# EAGLE design indicators (EAGLE 6.6.0)
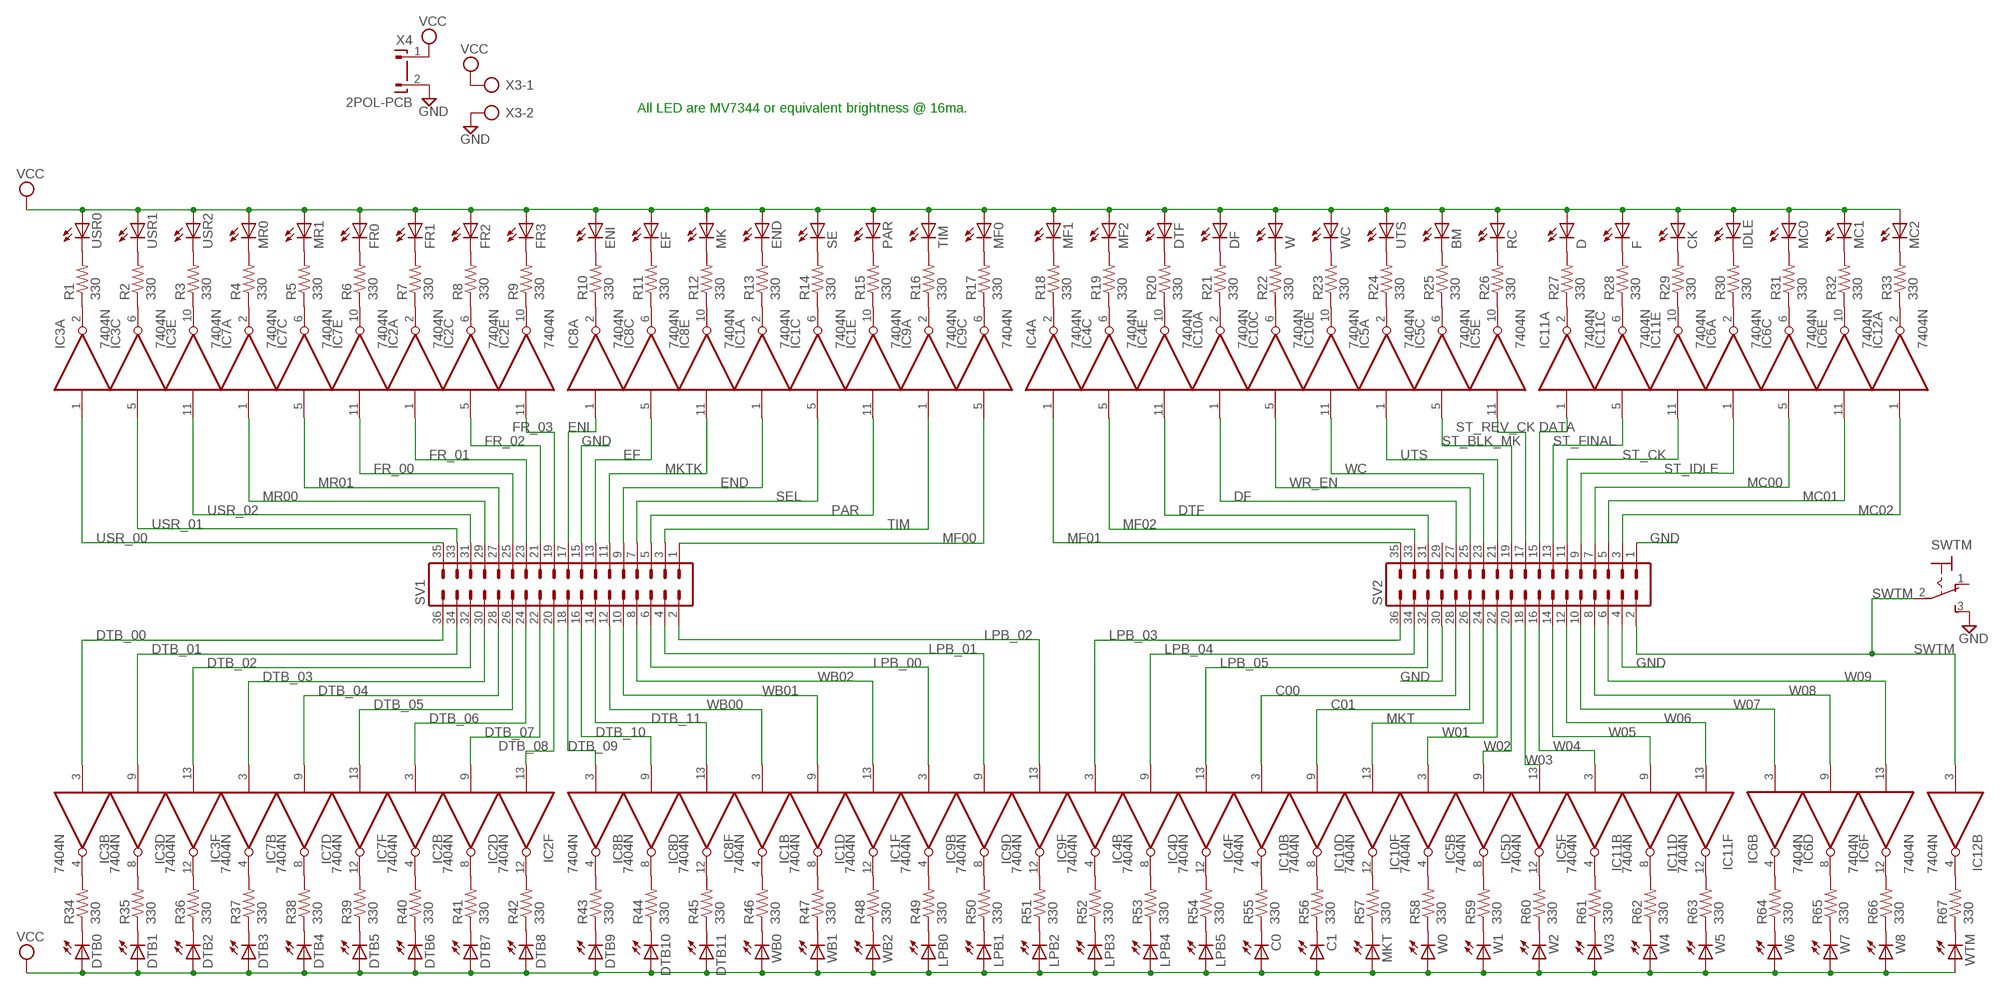
[diagram p0: schematic, sheet 1]

## Parts
BM  LED5MM  [LED5MM]
C0  LED5MM  [LED5MM]
C1  LED5MM  [LED5MM]
CK  LED5MM  [LED5MM]
D  LED5MM  [LED5MM]
DF  LED5MM  [LED5MM]
DTB0  LED5MM  [LED5MM]
DTB1  LED5MM  [LED5MM]
DTB2  LED5MM  [LED5MM]
DTB3  LED5MM  [LED5MM]
DTB4  LED5MM  [LED5MM]
DTB5  LED5MM  [LED5MM]
DTB6  LED5MM  [LED5MM]
DTB7  LED5MM  [LED5MM]
DTB8  LED5MM  [LED5MM]
DTB9  LED5MM  [LED5MM]
DTB10  LED5MM  [LED5MM]
DTB11  LED5MM  [LED5MM]
DTF  LED5MM  [LED5MM]
EF  LED5MM  [LED5MM]
END  LED5MM  [LED5MM]
ENI  LED5MM  [LED5MM]
F  LED5MM  [LED5MM]
FR0  LED5MM  [LED5MM]
FR1  LED5MM  [LED5MM]
FR2  LED5MM  [LED5MM]
FR3  LED5MM  [LED5MM]
IC1  7404N  [DIL14]
IC2  7404N  [DIL14]
IC3  7404N  [DIL14]
IC4  7404N  [DIL14]
IC5  7404N  [DIL14]
IC6  7404N  [DIL14]
IC7  7404N  [DIL14]
IC8  7404N  [DIL14]
IC9  7404N  [DIL14]
IC10  7404N  [DIL14]
IC11  7404N  [DIL14]
IC12  7404N  [DIL14]
IDLE  LED5MM  [LED5MM]
LPB0  LED5MM  [LED5MM]
LPB1  LED5MM  [LED5MM]
LPB2  LED5MM  [LED5MM]
LPB3  LED5MM  [LED5MM]
LPB4  LED5MM  [LED5MM]
LPB5  LED5MM  [LED5MM]
MC0  LED5MM  [LED5MM]
MC1  LED5MM  [LED5MM]
MC2  LED5MM  [LED5MM]
MF0  LED5MM  [LED5MM]
MF1  LED5MM  [LED5MM]
MF2  LED5MM  [LED5MM]
MK  LED5MM  [LED5MM]
MKT  LED5MM  [LED5MM]
MR0  LED5MM  [LED5MM]
MR1  LED5MM  [LED5MM]
PAR  LED5MM  [LED5MM]
R1  330  R-US_0207/10  [0207/10]
R2  330  R-US_0207/10  [0207/10]
R3  330  R-US_0207/10  [0207/10]
R4  330  R-US_0207/10  [0207/10]
R5  330  R-US_0207/10  [0207/10]
R6  330  R-US_0207/10  [0207/10]
R7  330  R-US_0207/10  [0207/10]
R8  330  R-US_0207/10  [0207/10]
R9  330  R-US_0207/10  [0207/10]
R10  330  R-US_0207/10  [0207/10]
R11  330  R-US_0207/10  [0207/10]
R12  330  R-US_0207/10  [0207/10]
R13  330  R-US_0207/10  [0207/10]
R14  330  R-US_0207/10  [0207/10]
R15  330  R-US_0207/10  [0207/10]
R16  330  R-US_0207/10  [0207/10]
R17  330  R-US_0207/10  [0207/10]
R18  330  R-US_0207/10  [0207/10]
R19  330  R-US_0207/10  [0207/10]
R20  330  R-US_0207/10  [0207/10]
R21  330  R-US_0207/10  [0207/10]
R22  330  R-US_0207/10  [0207/10]
R23  330  R-US_0207/10  [0207/10]
R24  330  R-US_0207/10  [0207/10]
R25  330  R-US_0207/10  [0207/10]
R26  330  R-US_0207/10  [0207/10]
R27  330  R-US_0207/10  [0207/10]
R28  330  R-US_0207/10  [0207/10]
R29  330  R-US_0207/10  [0207/10]
R30  330  R-US_0207/10  [0207/10]
R31  330  R-US_0207/10  [0207/10]
R32  330  R-US_0207/10  [0207/10]
R33  330  R-US_0207/10  [0207/10]
R34  330  R-US_0207/10  [0207/10]
R35  330  R-US_0207/10  [0207/10]
R36  330  R-US_0207/10  [0207/10]
R37  330  R-US_0207/10  [0207/10]
R38  330  R-US_0207/10  [0207/10]
R39  330  R-US_0207/10  [0207/10]
R40  330  R-US_0207/10  [0207/10]
R41  330  R-US_0207/10  [0207/10]
R42  330  R-US_0207/10  [0207/10]
R43  330  R-US_0207/10  [0207/10]
R44  330  R-US_0207/10  [0207/10]
R45  330  R-US_0207/10  [0207/10]
R46  330  R-US_0207/10  [0207/10]
R47  330  R-US_0207/10  [0207/10]
R48  330  R-US_0207/10  [0207/10]
R49  330  R-US_0207/10  [0207/10]
R50  330  R-US_0207/10  [0207/10]
R51  330  R-US_0207/10  [0207/10]
R52  330  R-US_0207/10  [0207/10]
R53  330  R-US_0207/10  [0207/10]
R54  330  R-US_0207/10  [0207/10]
R55  330  R-US_0207/10  [0207/10]
R56  330  R-US_0207/10  [0207/10]
R57  330  R-US_0207/10  [0207/10]
R58  330  R-US_0207/10  [0207/10]
R59  330  R-US_0207/10  [0207/10]
R60  330  R-US_0207/10  [0207/10]
R61  330  R-US_0207/10  [0207/10]
R62  330  R-US_0207/10  [0207/10]
R63  330  R-US_0207/10  [0207/10]
R64  330  R-US_0207/10  [0207/10]
R65  330  R-US_0207/10  [0207/10]
R66  330  R-US_0207/10  [0207/10]
R67  330  R-US_0207/10  [0207/10]
RC  LED5MM  [LED5MM]
SE  LED5MM  [LED5MM]
SV1  MA18-2  [MA18-2]
SV2  MA18-2  [MA18-2]
SWTM  M9040P  [M9040P]
TIM  LED5MM  [LED5MM]
USR0  LED5MM  [LED5MM]
USR1  LED5MM  [LED5MM]
USR2  LED5MM  [LED5MM]
UTS  LED5MM  [LED5MM]
W  LED5MM  [LED5MM]
W0  LED5MM  [LED5MM]
W1  LED5MM  [LED5MM]
W2  LED5MM  [LED5MM]
W3  LED5MM  [LED5MM]
W4  LED5MM  [LED5MM]
W5  LED5MM  [LED5MM]
W6  LED5MM  [LED5MM]
W7  LED5MM  [LED5MM]
W8  LED5MM  [LED5MM]
WB0  LED5MM  [LED5MM]
WB1  LED5MM  [LED5MM]
WB2  LED5MM  [LED5MM]
WC  LED5MM  [LED5MM]
WTM  LED5MM  [LED5MM]
X3  AK300/2  [AK300/2]
X4  2POL-PCB  [2POL-PCB]

## Nets
C00: IC10.3(B:I) SV2.28
C01: IC10.9(D:I) SV2.26
DATA: IC11.1(A:I) SV2.15
DF: IC10.1(A:I) SV2.27
DTB_00: IC3.3(B:I) SV1.36
DTB_01: IC3.9(D:I) SV1.34
DTB_02: IC3.13(F:I) SV1.32
DTB_03: IC7.3(B:I) SV1.30
DTB_04: IC7.9(D:I) SV1.28
DTB_05: IC7.13(F:I) SV1.26
DTB_06: IC2.3(B:I) SV1.24
DTB_07: IC2.9(D:I) SV1.22
DTB_08: IC2.13(F:I) SV1.20
DTB_09: IC8.3(B:I) SV1.18
DTB_10: IC8.9(D:I) SV1.16
DTB_11: IC8.13(F:I) SV1.14
DTF: IC4.11(E:I) SV2.31
EF: IC8.5(C:I) SV1.13
END: IC1.1(A:I) SV1.9
ENI: IC8.1(A:I) SV1.17
FR_00: IC7.11(E:I) SV1.25
FR_01: IC2.1(A:I) SV1.23
FR_02: IC2.5(C:I) SV1.21
FR_03: IC2.11(E:I) SV1.19
GND: SV1.15 SV2.1 SV2.4 SV2.30 SWTM.3(S) X3.2 X4.2
LPB_00: IC9.3(B:I) SV1.6
LPB_01: IC9.9(D:I) SV1.4
LPB_02: IC9.13(F:I) SV1.2
LPB_03: IC4.3(B:I) SV2.36
LPB_04: IC4.9(D:I) SV2.34
LPB_05: IC4.13(F:I) SV2.32
MC00: IC6.5(C:I) SV2.7
MC01: IC6.11(E:I) SV2.5
MC02: IC12.1(A:I) SV2.3
MF00: IC9.5(C:I) SV1.1
MF01: IC4.1(A:I) SV2.35
MF02: IC4.5(C:I) SV2.33
MKT: IC10.13(F:I) SV2.24
MKTK: IC8.11(E:I) SV1.11
MR00: IC7.1(A:I) SV1.29
MR01: IC7.5(C:I) SV1.27
N$1: R1.2 USR0.K(C)
N$2: R2.2 USR1.K(C)
N$3: R3.2 USR2.K(C)
N$4: MR0.K(C) R4.2
N$5: MR1.K(C) R5.2
N$6: FR0.K(C) R6.2
N$7: FR1.K(C) R7.2
N$8: FR2.K(C) R8.2
N$9: FR3.K(C) R9.2
N$10: ENI.K(C) R10.2
N$11: EF.K(C) R11.2
N$12: MK.K(C) R12.2
N$13: END.K(C) R13.2
N$14: R14.2 SE.K(C)
N$15: PAR.K(C) R15.2
N$16: R16.2 TIM.K(C)
N$17: MF0.K(C) R17.2
N$18: MF1.K(C) R18.2
N$19: MF2.K(C) R19.2
N$20: IC3.2(A:O) R1.1
N$21: IC3.6(C:O) R2.1
N$22: IC3.10(E:O) R3.1
N$23: IC7.2(A:O) R4.1
N$24: IC7.6(C:O) R5.1
N$25: IC7.10(E:O) R6.1
N$26: IC2.2(A:O) R7.1
N$27: IC2.6(C:O) R8.1
N$28: IC2.10(E:O) R9.1
N$29: IC8.2(A:O) R10.1
N$30: IC8.6(C:O) R11.1
N$31: IC8.10(E:O) R12.1
N$32: IC1.2(A:O) R13.1
N$33: IC1.6(C:O) R14.1
N$34: IC1.10(E:O) R15.1
N$35: IC9.2(A:O) R16.1
N$36: IC9.6(C:O) R17.1
N$37: IC4.2(A:O) R18.1
N$38: DTF.K(C) R20.2
N$57: DF.K(C) R21.2
N$58: R22.2 W.K(C)
N$59: R23.2 WC.K(C)
N$60: R24.2 UTS.K(C)
N$61: BM.K(C) R25.2
N$62: R26.2 RC.K(C)
N$63: D.K(C) R27.2
N$64: F.K(C) R28.2
N$65: CK.K(C) R29.2
N$66: IDLE.K(C) R30.2
N$67: MC0.K(C) R31.2
N$68: MC1.K(C) R32.2
N$69: MC2.K(C) R33.2
N$70: IC4.6(C:O) R19.1
N$71: IC4.10(E:O) R20.1
N$72: IC10.2(A:O) R21.1
N$73: IC10.10(E:O) R23.1
N$74: IC10.6(C:O) R22.1
N$75: IC5.2(A:O) R24.1
N$76: IC5.6(C:O) R25.1
N$77: IC5.10(E:O) R26.1
N$78: IC11.2(A:O) R27.1
N$79: IC11.6(C:O) R28.1
N$80: IC11.10(E:O) R29.1
N$81: IC6.2(A:O) R30.1
N$82: IC6.6(C:O) R31.1
N$83: IC6.10(E:O) R32.1
N$84: IC12.2(A:O) R33.1
N$89: DTB0.K(C) R34.1
N$90: DTB1.K(C) R35.1
N$91: DTB2.K(C) R36.1
N$92: DTB3.K(C) R37.1
N$93: DTB4.K(C) R38.1
N$94: DTB5.K(C) R39.1
N$95: DTB6.K(C) R40.1
N$96: DTB7.K(C) R41.1
N$97: DTB8.K(C) R42.1
N$98: DTB9.K(C) R43.1
N$99: DTB10.K(C) R44.1
N$100: DTB11.K(C) R45.1
N$101: R46.1 WB0.K(C)
N$102: R47.1 WB1.K(C)
N$103: R48.1 WB2.K(C)
N$104: LPB0.K(C) R49.1
N$105: LPB1.K(C) R50.1
N$106: LPB2.K(C) R51.1
N$107: LPB3.K(C) R52.1
N$108: LPB4.K(C) R53.1
N$109: LPB5.K(C) R54.1
N$110: C0.K(C) R55.1
N$111: C1.K(C) R56.1
N$112: MKT.K(C) R57.1
N$113: R58.1 W0.K(C)
N$114: R59.1 W1.K(C)
N$115: R60.1 W2.K(C)
N$116: R61.1 W3.K(C)
N$117: R62.1 W4.K(C)
N$118: R63.1 W5.K(C)
N$119: R64.1 W6.K(C)
N$120: R65.1 W7.K(C)
N$121: R66.1 W8.K(C)
N$122: R67.1 WTM.K(C)
N$123: IC3.4(B:O) R34.2
N$124: IC3.8(D:O) R35.2
N$125: IC3.12(F:O) R36.2
N$126: IC7.4(B:O) R37.2
N$127: IC7.8(D:O) R38.2
N$128: IC7.12(F:O) R39.2
N$129: IC2.4(B:O) R40.2
N$130: IC2.8(D:O) R41.2
N$131: IC2.12(F:O) R42.2
N$132: IC8.4(B:O) R43.2
N$133: IC8.8(D:O) R44.2
N$134: IC8.12(F:O) R45.2
N$135: IC1.4(B:O) R46.2
N$136: IC1.8(D:O) R47.2
N$137: IC1.12(F:O) R48.2
N$138: IC9.4(B:O) R49.2
N$139: IC9.8(D:O) R50.2
N$140: IC9.12(F:O) R51.2
N$141: IC4.4(B:O) R52.2
N$142: IC4.8(D:O) R53.2
N$143: IC4.12(F:O) R54.2
N$144: IC10.4(B:O) R55.2
N$145: IC10.8(D:O) R56.2
N$146: IC10.12(F:O) R57.2
N$147: IC5.4(B:O) R58.2
N$148: IC5.8(D:O) R59.2
N$149: IC5.12(F:O) R60.2
N$150: IC11.4(B:O) R61.2
N$151: IC11.8(D:O) R62.2
N$152: IC11.12(F:O) R63.2
N$153: IC6.4(B:O) R64.2
N$154: IC6.8(D:O) R65.2
N$155: IC6.12(F:O) R66.2
N$190: IC12.4(B:O) R67.2
PAR: IC1.11(E:I) SV1.5
SEL: IC1.5(C:I) SV1.7
ST_BLK_MK: IC5.5(C:I) SV2.19
ST_CK: IC11.11(E:I) SV2.11
ST_FINAL: IC11.5(C:I) SV2.13
ST_IDLE: IC6.1(A:I) SV2.9
ST_REV_CK: IC5.11(E:I) SV2.17
SWTM: IC12.3(B:I) SV2.2 SWTM.2(P)
TIM: IC9.1(A:I) SV1.3
USR_00: IC3.1(A:I) SV1.35
USR_01: IC3.5(C:I) SV1.33
USR_02: IC3.11(E:I) SV1.31
UTS: IC5.1(A:I) SV2.21
VCC: BM.A C0.A C1.A CK.A D.A DF.A DTB0.A DTB1.A DTB2.A DTB3.A DTB4.A DTB5.A DTB6.A DTB7.A DTB8.A DTB9.A DTB10.A DTB11.A DTF.A EF.A END.A ENI.A F.A FR0.A FR1.A FR2.A FR3.A IDLE.A LPB0.A LPB1.A LPB2.A LPB3.A LPB4.A LPB5.A MC0.A MC1.A MC2.A MF0.A MF1.A MF2.A MK.A MKT.A MR0.A MR1.A PAR.A RC.A SE.A TIM.A USR0.A USR1.A USR2.A UTS.A W0.A W1.A W2.A W3.A W4.A W5.A W6.A W7.A W8.A W.A WB0.A WB1.A WB2.A WC.A WTM.A X3.1 X4.1
W01: IC5.3(B:I) SV2.22
W02: IC5.9(D:I) SV2.20
W03: IC5.13(F:I) SV2.18
W04: IC11.3(B:I) SV2.16
W05: IC11.9(D:I) SV2.14
W06: IC11.13(F:I) SV2.12
W07: IC6.3(B:I) SV2.10
W08: IC6.9(D:I) SV2.8
W09: IC6.13(F:I) SV2.6
WB00: IC1.3(B:I) SV1.12
WB01: IC1.9(D:I) SV1.10
WB02: IC1.13(F:I) SV1.8
WC: IC10.11(E:I) SV2.23
WR_EN: IC10.5(C:I) SV2.25
Unconnected: IC9.10(E:O) IC9.11(E:I) IC12.5(C:I) IC12.6(C:O) IC12.8(D:O) IC12.9(D:I) IC12.10(E:O) IC12.11(E:I) IC12.12(F:O) IC12.13(F:I) SV2.29 SWTM.1(O)

## Notes on the sheet
- All LED are MV7344 or equivalent brightness @ 16ma.

## Power pins joined to a net without a drawn wire
GND: IC1.7(P:GND) IC2.7(P:GND) IC3.7(P:GND) IC4.7(P:GND) IC5.7(P:GND) IC6.7(P:GND) IC7.7(P:GND) IC8.7(P:GND) IC9.7(P:GND) IC10.7(P:GND) IC11.7(P:GND) IC12.7(P:GND)
VCC: IC1.14(P:VCC) IC2.14(P:VCC) IC3.14(P:VCC) IC4.14(P:VCC) IC5.14(P:VCC) IC6.14(P:VCC) IC7.14(P:VCC) IC8.14(P:VCC) IC9.14(P:VCC) IC10.14(P:VCC) IC11.14(P:VCC) IC12.14(P:VCC)

## Library data of the parts
BM C0 C1 CK D DF DTB0 DTB1-DTB11 DTF EF END ENI F FR0 FR1-FR3 IDLE LPB0 LPB1-LPB5 MC0 MC1 MC2 MF0 MF1 MF2 MK MKT MR0 MR1 PAR RC SE TIM USR0 USR1 USR2 UTS W W0 W1-W8 WB0 WB1 WB2 WC WTM = led:LED: LED OSRAM: - CHIPLED LG R971, LG N971, LY N971, LG Q971, LY Q971, LO R971, LY R971 LH N974, LH R974 LS Q976, LO Q976, LY Q976 LO Q996 - Hyper CHIPLED LW Q18S LB Q993, LB Q99A, LB R99A - SideLED LS A670, LO A670, LY A670, LG A670, LP A670 LB A673, LV A673, LT A673, LW A673 LH A674 LY A675 LS A676, LA A676, LO A676, LY A676, LW A676 LS A679, LY A679, LG A679 - Hyper Micro SIDELED® LS Y876, LA Y876, LO Y876, LY Y876 LT Y87S - SmartLED LW L88C, LW L88S LB L89C, LB L89S, LG L890 LS L89K, LO L89K, LY L89K LS L896, LA L896, LO L896, LY L896 - TOPLED LS T670, LO T670, LY T670, LG T670, LP T670 LSG T670, LSP T670, LSY T670, LOP T670, LYG T670 LG T671, LOG T671, LSG T671 LB T673, LV T673, LT T673, LW T673 LH T674 LS T676, LA T676, LO T676, LY T676, LB T676, LH T676, LSB T676, LW T676 LB T67C, LV T67C, LT T67C, LS T67K, LO T67K, LY T67K, LW E67C LS E67B, LA E67B, LO E67B, LY E67B, LB E67C, LV E67C, LT E67C LW T67C LS T679, LY T679, LG T679 LS T770, LO T770, LY T770, LG T770, LP T770 LB T773, LV T773, LT T773, LW T773 LH T774 LS E675, LA E675, LY E675, LS T675 LS T776, LA T776, LO T776, LY T776, LB T776 LHGB T686 LT T68C, LB T68C - Hyper Mini TOPLED® LB M676 - Mini TOPLED Santana® LG M470 LS M47K, LO M47K, LY M47K Source: http://www.osram.convergy.de LUXEON: - LUMILED® LXK2-PW12-R00, LXK2-PW12-S00, LXK2-PW14-U00, LXK2-PW14-V00 LXK2-PM12-R00, LXK2-PM12-S00, LXK2-PM14-U00 LXK2-PE12-Q00, LXK2-PE12-R00, LXK2-PE12-S00, LXK2-PE14-T00, LXK2-PE14-U00 LXK2-PB12-K00, LXK2-PB12-L00, LXK2-PB12-M00, LXK2-PB14-N00, LXK2-PB14-P00, LXK2-PB14-Q00 LXK2-PR12-L00, LXK2-PR12-M00, LXK2-PR14-Q00, LXK2-PR14-R00 LXK2-PD12-Q00, LXK2-PD12-R00, LXK2-PD12-S00 LXK2-PH12-R00, LXK2-PH12-S00 LXK2-PL12-P00, LXK2-PL12-Q00, LXK2-PL12-R00 Source: www.luxeon.com KINGBRIGHT: KA-3528ASYC Source: www.kingbright.com
IC1-IC12 = 74xx-us:74*04: Hex INVERTER
R1-R67 = rcl:R-US_: RESISTOR, American symbol
SV1 SV2 = con-lstb:MA18-2: PIN HEADER; OC_FARNELL: unknown; OC_NEWARK: unknown
SWTM = switch:M9040P: TOGGLE SWITCH Marquardt
X3 = con-ptr500:AK300/2: CONNECTOR; OC_FARNELL: unknown; OC_NEWARK: unknown
X4 = con-friwo:2POL-PCB: PCB SUPPLY CONNECTOR FRIWO (TEXAS); OC_FARNELL: unknown; OC_NEWARK: unknown

## Board
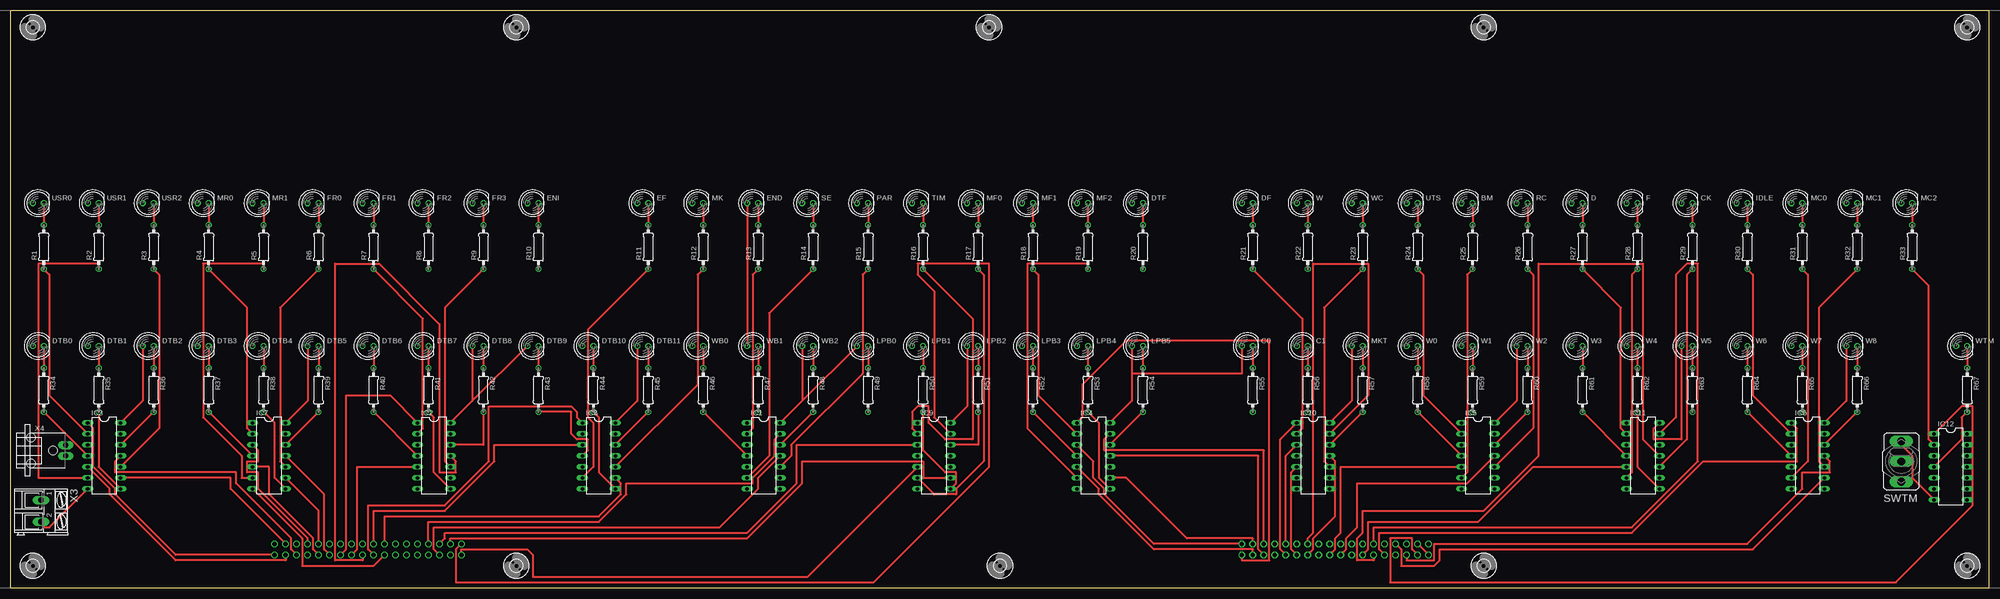
[diagram p1: board, top side]
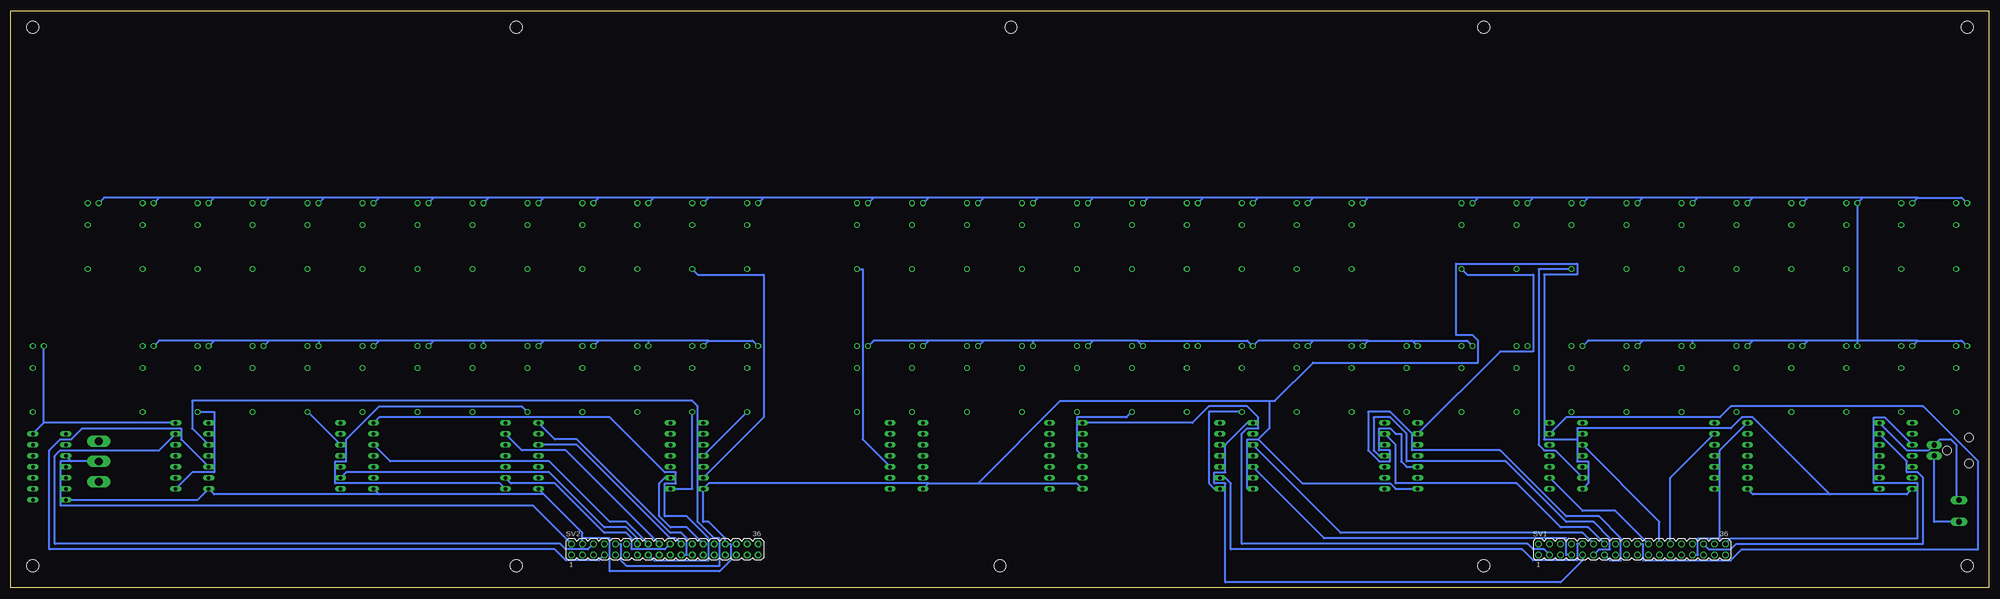
[diagram p2: board, bottom side, seen from below]

Size 457.2 x 133.35 mm. Coordinates in mm from the lower left corner, seen from the top.
Outline: 0,0 457.2,0 457.2,133.35 0,133.35 0,0
Copper layers (1+16): Top 0.035mm / dielectric 1.5mm / Bottom 0.035mm
Design rules "16mils": minimum track width 16mil, minimum drill 32mil, track to track 15mil, track to pad 10mil, pad to pad 10mil, via to via 10mil, smd to smd 10mil, copper to edge 13mil, drill to drill 10mil, minimum pad ring 10mil, minimum via ring 8mil, stop-mask expansion 0mil, vias tented up to drill 0mil, thermal gap 10mil

### Footprints (pad centres in the part's own frame; a part is rotated, then mirrored left to right if it is on the bottom)
LED5MM = drill 0.813 octagon: A -1.27,0; K 1.27,0
DIL14 = drill 0.813 long: 1 -7.62,-3.81; 2 -5.08,-3.81; 3 -2.54,-3.81; 4 0,-3.81; 5 2.54,-3.81; 6 5.08,-3.81; 7 7.62,-3.81; 8 7.62,3.81; 9 5.08,3.81; 10 2.54,3.81; 11 0,3.81; 12 -2.54,3.81; 13 -5.08,3.81; 14 -7.62,3.81
0207/10 = drill 0.813 octagon: 1 -5.08,0; 2 5.08,0
MA18-2 = drill 1.016 octagon: 1 -21.59,-1.27; 2 -21.59,1.27; 3 -19.05,-1.27; 4 -19.05,1.27; 5 -16.51,-1.27; 6 -16.51,1.27; 7 -13.97,-1.27; 8 -13.97,1.27; 9 -11.43,-1.27; 10 -11.43,1.27; 11 -8.89,-1.27; 12 -8.89,1.27; 13 -6.35,-1.27; 14 -6.35,1.27; 15 -3.81,-1.27; 16 -3.81,1.27; 17 -1.27,-1.27; 18 -1.27,1.27; 19 1.27,-1.27; 20 1.27,1.27; 21 3.81,-1.27; 22 3.81,1.27; 23 6.35,-1.27; 24 6.35,1.27; 25 8.89,-1.27; 26 8.89,1.27; 27 11.43,-1.27; 28 11.43,1.27; 29 13.97,-1.27; 30 13.97,1.27; 31 16.51,-1.27; 32 16.51,1.27; 33 19.05,-1.27; 34 19.05,1.27; 35 21.59,-1.27; 36 21.59,1.27
M9040P = drill 1.803 long: 1 0,4.699; 2 0,0; 3 0,-4.699
2,8 = hole 2.8: 0,0
AK300/2 = drill 1.321 long: 1 -2.515,0; 2 2.489,0
2POL-PCB = drill 1.2 long: 1 -1.25,11.6; 2 1.25,11.6 | hole 2: -3,3.6; 3,3.6; 0,8.6

### Placement (x,y rotation side)
BM  336.55,88.9 0 top
C0  285.75,55.88 0 top
C1  298.45,55.88 0 top
CK  387.35,88.9 0 top
D  361.95,88.9 0 top
DF  285.75,88.9 0 top
DTB0  6.35,55.88 0 top
DTB1  19.05,55.88 0 top
DTB2  31.75,55.88 0 top
DTB3  44.45,55.88 0 top
DTB4  57.15,55.88 0 top
DTB5  69.85,55.88 0 top
DTB6  82.55,55.88 0 top
DTB7  95.25,55.88 0 top
DTB8  107.95,55.88 0 top
DTB9  120.65,55.88 0 top
DTB10  133.35,55.88 0 top
DTB11  146.05,55.88 0 top
DTF  260.35,88.9 0 top
EF  146.05,88.9 0 top
END  171.45,88.9 0 top
ENI  120.65,88.9 0 top
F  374.65,88.9 0 top
FR0  69.85,88.9 0 top
FR1  82.55,88.9 0 top
FR2  95.25,88.9 0 top
FR3  107.95,88.9 0 top
IC1  173.99,30.48 270 top
IC2  97.79,30.48 270 top
IC3  21.59,30.48 270 top
IC4  250.19,30.48 270 top
IC5  339.09,30.48 270 top
IC6  415.29,30.48 270 top
IC7  59.69,30.48 270 top
IC8  135.89,30.48 270 top
IC9  213.36,30.48 270 top
IC10  300.99,30.48 270 top
IC11  377.19,30.48 270 top
IC12  448.31,27.94 270 top
IDLE  400.05,88.9 0 top
LPB0  196.85,55.88 0 top
LPB1  209.55,55.88 0 top
LPB2  222.25,55.88 0 top
LPB3  234.95,55.88 0 top
LPB4  247.65,55.88 0 top
LPB5  260.35,55.88 0 top
MC0  412.75,88.9 0 top
MC1  425.45,88.9 0 top
MC2  438.15,88.9 0 top
MF0  222.25,88.9 0 top
MF1  234.95,88.9 0 top
MF2  247.65,88.9 0 top
MK  158.75,88.9 0 top
MKT  311.15,55.88 0 top
MR0  44.45,88.9 0 top
MR1  57.15,88.9 0 top
PAR  196.85,88.9 0 top
R1  7.62,78.74 90 top
R2  20.32,78.74 90 top
R3  33.02,78.74 90 top
R4  45.72,78.74 90 top
R5  58.42,78.74 90 top
R6  71.12,78.74 90 top
R7  83.82,78.74 90 top
R8  96.52,78.74 90 top
R9  109.22,78.74 90 top
R10  121.92,78.74 90 top
R11  147.32,78.74 90 top
R12  160.02,78.74 90 top
R13  172.72,78.74 90 top
R14  185.42,78.74 90 top
R15  198.12,78.74 90 top
R16  210.82,78.74 90 top
R17  223.52,78.74 90 top
R18  236.22,78.74 90 top
R19  248.92,78.74 90 top
R20  261.62,78.74 90 top
R21  287.02,78.74 90 top
R22  299.72,78.74 90 top
R23  312.42,78.74 90 top
R24  325.12,78.74 90 top
R25  337.82,78.74 90 top
R26  350.52,78.74 90 top
R27  363.22,78.74 90 top
R28  375.92,78.74 90 top
R29  388.62,78.74 90 top
R30  401.32,78.74 90 top
R31  414.02,78.74 90 top
R32  426.72,78.74 90 top
R33  439.42,78.74 90 top
R34  7.62,45.72 270 top
R35  20.32,45.72 270 top
R36  33.02,45.72 270 top
R37  45.72,45.72 270 top
R38  58.42,45.72 270 top
R39  71.12,45.72 270 top
R40  83.82,45.72 270 top
R41  96.52,45.72 270 top
R42  109.22,45.72 270 top
R43  121.92,45.72 270 top
R44  134.62,45.72 270 top
R45  147.32,45.72 270 top
R46  160.02,45.72 270 top
R47  172.72,45.72 270 top
R48  185.42,45.72 270 top
R49  198.12,45.72 270 top
R50  210.82,45.72 270 top
R51  223.52,45.72 270 top
R52  236.22,45.72 270 top
R53  248.92,45.72 270 top
R54  261.62,45.72 270 top
R55  287.02,45.72 270 top
R56  299.72,45.72 270 top
R57  312.42,45.72 270 top
R58  325.12,45.72 270 top
R59  337.82,45.72 270 top
R60  350.52,45.72 270 top
R61  363.22,45.72 270 top
R62  375.92,45.72 270 top
R63  388.62,45.72 270 top
R64  401.32,45.72 270 top
R65  414.02,45.72 270 top
R66  426.72,45.72 270 top
R67  452.12,45.72 270 top
RC  349.25,88.9 0 top
SE  184.15,88.9 0 top
SV1  82.55,8.89 0 bottom
SV2  306.07,8.89 0 bottom
SWTM  436.88,29.21 180 top
TIM  209.55,88.9 0 top
U$1  [2,8]  5.08,5.08 0 top
U$2  [2,8]  5.08,129.54 0 top
U$3  [2,8]  116.84,5.08 0 top
U$4  [2,8]  116.84,129.54 0 top
U$5  [2,8]  226.06,129.54 0 top
U$6  [2,8]  228.6,5.08 0 top
U$7  [2,8]  340.36,129.54 0 top
U$8  [2,8]  340.36,5.08 0 top
U$9  [2,8]  452.12,129.54 0 top
U$10  [2,8]  452.12,5.08 0 top
USR0  6.35,88.9 0 top
USR1  19.05,88.9 0 top
USR2  31.75,88.9 0 top
UTS  323.85,88.9 0 top
W  298.45,88.9 0 top
W0  323.85,55.88 0 top
W1  336.55,55.88 0 top
W2  349.25,55.88 0 top
W3  361.95,55.88 0 top
W4  374.65,55.88 0 top
W5  387.35,55.88 0 top
W6  400.05,55.88 0 top
W7  412.75,55.88 0 top
W8  425.45,55.88 0 top
WB0  158.75,55.88 0 top
WB1  171.45,55.88 0 top
WB2  184.15,55.88 0 top
WC  311.15,88.9 0 top
WTM  450.85,55.88 0 top
X3  6.99,17.78 270 top
X4  1.11,31.75 270 top

### Tracks (layer width: path | path; a pad name or v marks a point on that pad's centre or on a via)
C00
  Top 0.406: IC10.3 294.64,30.48 SV2.28
C01
  Bottom 0.406: IC10.9 306.07,25.4 307.34,24.13 307.34,16.51 304.8,13.97 300.99,13.97 SV2.26
DATA
  Bottom 0.406: IC11.1 372.11,39.37 318.77,39.37 306.07,26.67 303.53,26.67 303.53,24.13 306.07,24.13 306.07,16.51 300.99,16.51 295.91,11.43 295.91,6.35 308.61,6.35 SV2.15
DF
  Top 0.406: IC10.1 293.37,34.29 293.37,8.89 SV2.27
DTB_00
  Bottom 0.406: IC3.3 24.13,39.37 26.67,39.37 26.67,24.13 16.51,24.13 16.51,11.43 59.69,11.43 SV1.36
DTB_01
  Top 0.406: IC3.9 50.8,25.4 50.8,22.86 SV1.34
DTB_02
  Bottom 0.406: IC3.13 19.05,29.21 19.05,26.67 16.51,26.67 15.24,25.4 15.24,10.16 58.42,10.16 59.69,8.89 64.77,8.89 SV1.32
DTB_03
  Top 0.406: IC7.3 57.15,31.75 57.15,29.21 54.61,29.21 54.61,26.67 57.15,26.67 57.15,22.86 68.58,11.43 SV1.30
DTB_04
  Top 0.406: IC7.9 71.12,17.78 SV1.28
DTB_05
  Bottom 0.406: IC7.13 73.66,25.4 SV1.26
DTB_06
  Bottom 0.406: IC2.3 76.2,15.24 SV1.24
DTB_07
  Bottom 0.406: IC2.9 93.98,17.78 86.36,17.78 SV1.22
DTB_08
  Bottom 0.406: IC2.13 97.79,39.37 62.23,39.37 59.69,41.91 15.24,41.91 2.54,29.21 2.54,8.89 57.15,8.89 59.69,6.35 80.01,6.35 80.01,10.16 SV1.20
DTB_09
  Top 0.406: IC8.3 111.76,33.02 111.76,29.21 100.33,17.78 83.82,17.78 SV1.18
DTB_10
  Top 0.406: IC8.9 140.97,24.13 140.97,21.59 135.89,16.51 86.36,16.51 SV1.16
DTB_11
  Bottom 0.406: IC8.13 137.16,33.02 137.16,24.13 109.22,24.13 99.06,13.97 92.71,13.97 SV1.14
DTF
  Top 0.406: IC4.11 288.29,30.48 288.29,8.89 SV2.31
EF
  Bottom 0.406: IC8.5 134.62,27.94 135.89,29.21 135.89,35.56 137.16,35.56 138.43,36.83 140.97,36.83 140.97,31.75 138.43,31.75 138.43,29.21 140.97,29.21 143.51,31.75 143.51,40.64 138.43,40.64 133.35,35.56 133.35,31.75 113.03,31.75 97.79,16.51 90.17,16.51 85.09,11.43 85.09,6.35 87.63,6.35 SV1.13
END
  Bottom 0.406: IC1.1 171.45,38.1 176.53,33.02 176.53,26.67 179.07,26.67 179.07,24.13 176.53,24.13 176.53,1.27 99.06,1.27 93.98,6.35 SV1.9
ENI
  Top 0.406: IC8.1 130.81,39.37 130.81,40.64 129.54,41.91 110.49,41.91 110.49,29.21 100.33,19.05 82.55,19.05 82.55,8.89 SV1.17
FR_00
  Top 0.406: IC7.11 72.39,21.59 72.39,8.89 SV1.25
FR_01
  Top 0.406: IC2.1 87.63,44.45 77.47,44.45 77.47,8.89 SV1.23
FR_02
  Top 0.406: IC2.5 80.01,27.94 80.01,8.89 SV1.21
FR_03
  Top 0.406: IC2.11 102.87,29.21 102.87,26.67 99.06,26.67 99.06,60.96 85.09,74.93 74.93,74.93 74.93,6.35 81.28,6.35 SV1.19
GND
  Top 0.406: IC12.7 439.42,25.4 439.42,30.48 436.88,33.02 SWTM.3 | SV2.4 SV2.1 | IC3.7 8.89,13.97 7.62,13.97 7.62,15.24 X3.2 | SV1.15 83.82,5.08 67.31,5.08 67.31,11.43 IC7.7
  Bottom 0.406: IC12.7 414.02,20.32 IC6.7 410.21,21.59 372.11,21.59 | 334.01,21.59 325.12,12.7 325.12,11.43 | 334.01,21.59 IC5.7 | SV2.4 325.12,11.43 | 372.11,21.59 IC11.7 | 334.01,21.59 372.11,21.59 | IC7.7 54.61,21.59 36.83,21.59 | 36.83,21.59 19.05,21.59 IC3.7 | IC2.7 92.71,24.13 92.71,29.21 95.25,29.21 95.25,34.29 | 95.25,34.29 95.25,36.83 59.69,36.83 57.15,39.37 54.61,39.37 36.83,21.59 | X4.2 12.7,30.48 12.7,15.24 7.62,15.24 X3.2 | IC8.7 137.16,22.86 138.43,24.13 158.75,24.13 168.91,34.29 | 168.91,34.29 171.45,34.29 171.45,22.86 IC1.7 | IC9.7 210.82,24.13 233.68,24.13 | 245.11,24.13 233.68,24.13 | IC4.7 245.11,24.13 | 245.11,24.13 295.91,24.13 IC10.7 297.18,15.24 295.91,15.24 292.1,11.43 SV2.30 290.83,10.16 290.83,6.35 293.37,3.81 318.77,3.81 318.77,11.43 325.12,11.43 | 168.91,34.29 166.37,36.83 166.37,43.18 | 166.37,43.18 214.63,43.18 233.68,24.13 | 95.25,34.29 102.87,34.29 102.87,72.39 95.25,72.39 95.25,74.93 123.19,74.93 123.19,58.42 119.38,58.42 118.11,57.15 118.11,52.07 156.21,52.07 165.1,43.18 166.37,43.18
LPB_00
  Top 0.406: IC9.3 181.61,33.02 181.61,24.13 170.18,12.7 100.33,12.7 100.33,11.43 SV1.6
LPB_01
  Top 0.406: IC9.9 210.82,25.4 210.82,29.21 182.88,29.21 182.88,24.13 170.18,11.43 101.6,11.43 SV1.4
LPB_02
  Top 0.406: IC9.13 213.36,39.37 213.36,68.58 209.55,72.39 209.55,74.93 226.06,74.93 226.06,27.94 199.39,1.27 102.87,1.27 102.87,8.89 SV1.2
LPB_03
  Top 0.406: IC4.3 250.19,29.21 250.19,25.4 252.73,22.86 252.73,21.59 264.16,10.16 SV2.36
LPB_04
  Top 0.406: IC4.9 257.81,25.4 271.78,11.43 287.02,11.43 SV2.34
LPB_05
  Top 0.406: IC4.13 252.73,34.29 252.73,31.75 289.56,31.75 SV2.32
MC00
  Bottom 0.406: IC6.5 417.83,34.29 417.83,36.83 440.69,36.83 443.23,34.29 445.77,34.29 448.31,31.75 448.31,8.89 331.47,8.89 328.93,6.35 321.31,6.35 SV2.7
MC01
  Top 0.406: IC6.11 420.37,29.21 420.37,26.67 414.02,26.67 414.02,22.86 401.32,10.16 328.93,10.16 328.93,6.35 322.58,6.35 SV2.5
MC02
  Top 0.406: IC12.1 450.85,41.91 453.39,41.91 453.39,19.05 435.61,1.27 318.77,1.27 318.77,11.43 323.85,11.43 323.85,8.89 SV2.3
MF00
  Top 0.406: IC9.5 184.15,2.54 120.65,2.54 120.65,7.62 119.38,8.89 104.14,8.89 SV1.1
MF01
  Top 0.406: IC4.1 247.65,39.37 247.65,46.99 257.81,57.15 290.83,57.15 290.83,6.35 284.48,6.35 SV2.35
MF02
  Top 0.406: IC4.5 251.46,22.86 251.46,21.59 264.16,8.89 287.02,8.89 SV2.33
MKT
  Top 0.406: IC10.13 313.69,44.45 313.69,74.93 300.99,74.93 300.99,12.7 299.72,11.43 SV2.24
MKTK
  Bottom 0.406: IC8.11 140.97,30.48 142.24,31.75 142.24,39.37 138.43,39.37 134.62,35.56 134.62,29.21 111.76,29.21 97.79,15.24 91.44,15.24 87.63,11.43 87.63,8.89 90.17,8.89 SV1.11
MR00
  Bottom 0.406: IC7.1 62.23,31.75 62.23,11.43 67.31,11.43 67.31,7.62 SV1.29
MR01
  Top 0.406: IC7.5 59.69,27.94 59.69,21.59 69.85,11.43 69.85,8.89 SV1.27
N$1
  Top 0.406: USR0.K R1.2
N$2
  Top 0.406: USR1.K R2.2
N$3
  Top 0.406: USR2.K R3.2
N$4
  Top 0.406: MR0.K R4.2
N$5
  Top 0.406: MR1.K R5.2
N$6
  Top 0.406: FR0.K R6.2
N$7
  Top 0.406: FR1.K R7.2
N$8
  Top 0.406: FR2.K R8.2
N$9
  Top 0.406: FR3.K R9.2
N$10
  Top 0.406: ENI.K R10.2
N$11
  Top 0.406: EF.K R11.2
N$12
  Top 0.406: MK.K R12.2
N$13
  Top 0.406: END.K R13.2
N$14
  Top 0.406: SE.K R14.2
N$15
  Top 0.406: PAR.K R15.2
N$16
  Top 0.406: TIM.K R16.2
N$17
  Top 0.406: MF0.K R17.2
N$18
  Top 0.406: MF1.K R18.2
N$19
  Top 0.406: MF2.K R19.2
N$20
  Top 0.406: IC3.2 8.89,44.45 8.89,72.39 R1.1
N$21
  Top 0.406: IC3.6 6.35,25.4 6.35,74.93 20.32,74.93 R2.1
N$22
  Top 0.406: IC3.10 34.29,36.83 34.29,72.39 R3.1
N$23
  Top 0.406: R4.1 54.61,64.77 54.61,36.83 IC7.2
N$24
  Top 0.406: IC7.6 53.34,25.4 53.34,30.48 44.45,39.37 44.45,74.93 58.42,74.93 R5.1
N$25
  Top 0.406: IC7.10 62.23,29.21 62.23,64.77 R6.1
N$26
  Top 0.406: R7.1 95.25,62.23 95.25,36.83 IC2.2
N$27
  Bottom 0.406: IC2.6 100.33,31.75 102.87,31.75 104.14,33.02 104.14,73.66 R8.1
N$28
  Top 0.406: IC2.10 100.33,29.21 100.33,64.77 R9.1
N$29
  Bottom 0.406: IC8.2 113.03,54.61 105.41,54.61 105.41,72.39 120.65,72.39 R10.1
N$30
  Top 0.406: IC8.6 134.62,27.94 134.62,38.1 133.35,39.37 133.35,59.69 R11.1
N$31
  Top 0.406: IC8.10 158.75,46.99 158.75,72.39 R12.1
N$32
  Top 0.406: IC1.2 171.45,36.83 171.45,72.39 R13.1
N$33
  Top 0.406: IC1.6 175.26,30.48 175.26,63.5 R14.1
N$34
  Top 0.406: IC1.10 180.34,30.48 180.34,33.02 196.85,49.53 196.85,72.39 R15.1
N$35
  Top 0.406: IC9.2 208.28,36.83 208.28,40.64 209.55,41.91 212.09,41.91 212.09,38.1 215.9,34.29 222.25,34.29 222.25,62.23 R16.1
N$36
  Top 0.406: IC9.6 213.36,21.59 218.44,21.59 218.44,22.86 224.79,29.21 224.79,72.39 R17.1
N$37
  Top 0.406: IC4.2 237.49,44.45 237.49,72.39 R18.1
N$38
  Top 0.406: DTF.K R20.2
N$57
  Top 0.406: DF.K R21.2
N$58
  Top 0.406: W.K R22.2
N$59
  Top 0.406: WC.K R23.2
N$60
  Top 0.406: UTS.K R24.2
N$61
  Top 0.406: BM.K R25.2
N$62
  Top 0.406: RC.K R26.2
N$63
  Top 0.406: D.K R27.2
N$64
  Top 0.406: F.K R28.2
N$65
  Top 0.406: CK.K R29.2
N$66
  Top 0.406: IDLE.K R30.2
N$67
  Top 0.406: MC0.K R31.2
N$68
  Top 0.406: MC1.K R32.2
N$69
  Top 0.406: MC2.K R33.2
N$70
  Top 0.406: IC4.6 234.95,36.83 234.95,74.93 248.92,74.93 R19.1
N$71
  Bottom 0.406: IC4.10 260.35,34.29 260.35,73.66 R20.1
N$72
  Top 0.406: IC10.2 298.45,36.83 298.45,62.23 R21.1
N$73
  Top 0.406: IC10.10 303.53,29.21 303.53,64.77 R23.1
N$74
  Bottom 0.406: IC10.6 283.21,39.37 283.21,72.39 298.45,72.39 R22.1
N$75
  Top 0.406: IC5.2 326.39,44.45 326.39,72.39 R24.1
N$76
  Top 0.406: IC5.6 336.55,26.67 336.55,72.39 R25.1
N$77
  Top 0.406: IC5.10 351.79,36.83 351.79,72.39 R26.1
N$78
  Top 0.406: R27.1 372.11,64.77 372.11,36.83 IC11.2
N$79
  Top 0.406: IC11.6 374.65,26.67 374.65,72.39 R28.1
N$80
  Top 0.406: IC11.10 387.35,34.29 387.35,72.39 R29.1
N$81
  Top 0.406: IC6.2 402.59,44.45 402.59,72.39 R30.1
N$82
  Top 0.406: IC6.6 415.29,29.21 415.29,72.39 R31.1
N$83
  Top 0.406: IC6.10 417.83,29.21 417.83,64.77 R32.1
N$84
  Top 0.406: R33.1 443.23,69.85 443.23,34.29 IC12.2
N$89
  Top 0.406: DTB0.K R34.1
N$90
  Top 0.406: DTB1.K R35.1
N$91
  Top 0.406: DTB2.K R36.1
N$92
  Top 0.406: DTB3.K R37.1
N$93
  Top 0.406: DTB4.K R38.1
N$94
  Top 0.406: DTB5.K R39.1
N$95
  Top 0.406: DTB6.K R40.1
N$96
  Top 0.406: DTB7.K R41.1
N$97
  Top 0.406: DTB8.K R42.1
N$98
  Top 0.406: DTB9.K R43.1
N$99
  Top 0.406: DTB10.K R44.1
N$100
  Top 0.406: DTB11.K R45.1
N$101
  Top 0.406: WB0.K R46.1
N$102
  Top 0.406: WB1.K R47.1
N$103
  Top 0.406: WB2.K R48.1
N$104
  Top 0.406: LPB0.K R49.1
N$105
  Top 0.406: LPB1.K R50.1
N$106
  Top 0.406: LPB2.K R51.1
N$107
  Top 0.406: LPB3.K R52.1
N$108
  Top 0.406: LPB4.K R53.1
N$109
  Top 0.406: LPB5.K R54.1
N$110
  Top 0.406: C0.K R55.1
N$111
  Top 0.406: C1.K R56.1
N$112
  Top 0.406: MKT.K R57.1
N$113
  Top 0.406: W0.K R58.1
N$114
  Top 0.406: W1.K R59.1
N$115
  Top 0.406: W2.K R60.1
N$116
  Top 0.406: W3.K R61.1
N$117
  Top 0.406: W4.K R62.1
N$118
  Top 0.406: W5.K R63.1
N$119
  Top 0.406: W6.K R64.1
N$120
  Top 0.406: W7.K R65.1
N$121
  Top 0.406: W8.K R66.1
N$122
  Top 0.406: WTM.K R67.1
N$123
  Top 0.406: IC3.4 R34.2
N$124
  Top 0.406: IC3.8 20.32,27.94 R35.2
N$125
  Top 0.406: R36.2 IC3.12
N$126
  Top 0.406: IC7.4 R37.2
N$127
  Top 0.406: R38.2 60.96,38.1 60.96,25.4 IC7.8
N$128
  Top 0.406: R39.2 IC7.12
N$129
  Top 0.406: IC2.4 R40.2
N$130
  Top 0.406: R41.2 97.79,39.37 97.79,26.67 IC2.8
N$131
  Top 0.406: IC2.12 109.22,33.02 R42.2
N$132
  Top 0.406: R43.2 129.54,40.64 129.54,35.56 130.81,34.29 133.35,34.29 133.35,31.75 IC8.4
N$133
  Top 0.406: IC8.8 135.89,26.67 135.89,39.37 R44.2
N$134
  Top 0.406: R45.2 IC8.12
N$135
  Top 0.406: IC1.4 R46.2
N$136
  Bottom 0.406: IC1.8 179.07,22.86 180.34,24.13 180.34,40.64 R47.2
N$137
  Top 0.406: R48.2 IC1.12
N$138
  Bottom 0.406: IC9.4 210.82,31.75 210.82,39.37 199.39,39.37 R49.2
N$139
  Top 0.406: R50.2 210.82,31.75 215.9,26.67 218.44,26.67 218.44,24.13 IC9.8
N$140
  Top 0.406: IC9.12 223.52,33.02 R51.2
N$141
  Top 0.406: IC4.4 R52.2
N$142
  Top 0.406: IC4.8 251.46,25.4 251.46,38.1 R53.2
N$143
  Top 0.406: R54.2 IC4.12
N$144
  Bottom 0.406: IC10.4 R55.2
N$145
  Bottom 0.406: R56.2 299.72,22.86 IC10.8
N$146
  Top 0.406: R57.2 IC10.12
N$147
  Top 0.406: IC5.4 R58.2
N$148
  Bottom 0.406: R59.2 339.09,41.91 372.11,41.91 379.73,34.29 379.73,29.21 382.27,29.21 382.27,24.13 344.17,24.13 IC5.8
N$149
  Top 0.406: R60.2 IC5.12
N$150
  Top 0.406: IC11.4 R61.2
N$151
  Top 0.406: IC11.8 375.92,27.94 R62.2
N$152
  Bottom 0.406: R63.2 IC11.12
N$153
  Top 0.406: IC6.4 R64.2
N$154
  Bottom 0.406: IC6.8 415.29,26.67 410.21,26.67 410.21,40.64 R65.2
N$155
  Top 0.406: R66.2 IC6.12
N$190
  Top 0.406: IC12.4 450.85,34.29 450.85,39.37 R67.2
PAR
  Top 0.406: IC1.11 172.72,25.4 172.72,22.86 163.83,13.97 97.79,13.97 97.79,8.89 SV1.5
SEL
  Bottom 0.406: IC1.5 153.67,11.43 97.79,11.43 97.79,7.62 SV1.7
ST_BLK_MK
  Top 0.406: IC5.5 307.34,27.94 307.34,12.7 306.07,11.43 306.07,8.89 SV2.19
ST_CK
  Top 0.406: IC11.11 377.19,34.29 377.19,74.93 353.06,74.93 353.06,30.48 340.36,17.78 312.42,17.78 312.42,12.7 311.15,11.43 311.15,6.35 314.96,6.35 SV2.11
ST_FINAL
  Top 0.406: IC11.5 351.79,27.94 339.09,15.24 313.69,15.24 313.69,8.89 SV2.13
ST_IDLE
  Top 0.406: IC6.1 412.75,36.83 412.75,29.21 391.16,29.21 374.65,12.7 316.23,12.7 316.23,8.89 SV2.9
ST_REV_CK
  Top 0.406: IC5.11 336.55,24.13 311.15,24.13 311.15,13.97 308.61,11.43 308.61,8.89 SV2.17
SWTM
  Bottom 0.406: 443.23,29.21 IC12.3 | SWTM.2 443.23,29.21 | SV2.2 336.55,19.05 445.77,19.05 445.77,29.21 443.23,29.21
TIM
  Bottom 0.406: IC9.1 184.15,38.1 180.34,41.91 171.45,41.91 168.91,39.37 168.91,36.83 171.45,36.83 172.72,35.56 172.72,10.16 106.68,10.16 105.41,8.89 102.87,8.89 SV1.3
USR_00
  Top 0.406: IC3.1 19.05,36.83 19.05,27.94 24.13,22.86 24.13,21.59 38.1,7.62 SV1.35
USR_01
  Top 0.406: IC3.5 22.86,22.86 22.86,21.59 38.1,6.35 63.5,6.35 SV1.33
USR_02
  Top 0.406: IC3.11 24.13,29.21 24.13,26.67 52.07,26.67 52.07,24.13 64.77,11.43 64.77,8.89 SV1.31
UTS
  Bottom 0.406: IC5.1 331.47,34.29 326.39,34.29 304.8,12.7 302.26,12.7 300.99,11.43 300.99,7.62 SV2.21
VCC
  Top 0.406: 106.68,43.18 IC2.14 | DTB8.A 106.68,43.18 | 106.68,43.18 DTB9.A | IC8.14 144.78,43.18 DTB11.A | IC4.14 259.08,43.18 259.08,49.53 | LPB5.A 259.08,49.53 | IC9.14 220.98,41.91 LPB2.A | 182.88,43.18 IC1.14 | WB2.A 182.88,43.18 | 182.88,43.18 LPB0.A | IC6.14 424.18,43.18 W8.A | IC11.14 379.73,36.83 379.73,34.29 386.08,34.29 W5.A | IC5.14 347.98,43.18 W2.A | IC10.14 309.88,43.18 MKT.A | 259.08,49.53 284.48,49.53 C0.A | IC3.14 30.48,43.18 DTB2.A | IC7.14 68.58,43.18 DTB5.A | END.A WB1.A
  Bottom 0.406: 133.35,57.15 DTB10.A | 143.51,57.15 133.35,57.15 | DTB11.A 143.51,57.15 | 156.21,57.15 WB0.A | 143.51,57.15 156.21,57.15 | 156.21,57.15 168.91,57.15 WB1.A 171.45,57.15 196.85,57.15 | DTB9.A 120.65,57.15 133.35,57.15 | 207.01,57.15 LPB1.A | 196.85,57.15 207.01,57.15 | LPB0.A 196.85,57.15 | 232.41,57.15 LPB3.A | 207.01,57.15 220.98,57.15 | 220.98,57.15 232.41,57.15 | 245.11,57.15 LPB4.A | 232.41,57.15 245.11,57.15 | 220.98,57.15 LPB2.A | LPB5.A 257.81,57.15 245.11,57.15 | 449.58,38.1 IC12.14 | IC6.14 449.58,38.1 | 449.58,38.1 WTM.A | C0.A 285.75,57.15 295.91,57.15 | C1.A 295.91,57.15 | 321.31,57.15 W0.A | 295.91,57.15 309.88,57.15 | 309.88,57.15 321.31,57.15 | 334.01,57.15 W1.A | 321.31,57.15 334.01,57.15 | 359.41,57.15 W3.A | 334.01,57.15 347.98,57.15 | 347.98,57.15 359.41,57.15 | 372.11,57.15 W4.A | 359.41,57.15 372.11,57.15 | 397.51,57.15 W6.A | 372.11,57.15 386.08,57.15 | 386.08,57.15 397.51,57.15 | 410.21,57.15 W7.A | 397.51,57.15 410.21,57.15 | 309.88,57.15 MKT.A | 347.98,57.15 W2.A | 386.08,57.15 W5.A | W8.A 422.91,57.15 410.21,57.15 | 12.7,33.02 13.97,31.75 19.05,31.75 IC3.14 | 12.7,33.02 11.43,34.29 8.89,34.29 7.62,33.02 7.62,20.32 X3.1 | 12.7,33.02 X4.1 | DTB0.A 6.35,57.15 16.51,57.15 | DTB1.A 16.51,57.15 | 41.91,57.15 DTB3.A | 16.51,57.15 30.48,57.15 | 30.48,57.15 41.91,57.15 | 54.61,57.15 DTB4.A | 41.91,57.15 54.61,57.15 | 80.01,57.15 DTB6.A | 54.61,57.15 68.58,57.15 | 68.58,57.15 80.01,57.15 | DTB7.A 92.71,57.15 80.01,57.15 | 68.58,57.15 DTB5.A | 30.48,57.15 DTB2.A | USR0.A 6.35,90.17 16.51,90.17 | USR1.A 16.51,90.17 | 29.21,90.17 USR2.A 30.48,57.15 | 16.51,90.17 29.21,90.17 | 41.91,90.17 MR0.A | 29.21,90.17 41.91,90.17 | 54.61,90.17 MR1.A | 41.91,90.17 54.61,90.17
  Bottom 0.406: 67.31,90.17 FR0.A | 54.61,90.17 67.31,90.17 | 80.01,90.17 FR1.A | 67.31,90.17 80.01,90.17 | 92.71,90.17 FR2.A | 80.01,90.17 92.71,90.17 | 105.41,90.17 FR3.A | 92.71,90.17 105.41,90.17 | 118.11,90.17 ENI.A | 105.41,90.17 118.11,90.17 | 143.51,90.17 EF.A | 118.11,90.17 143.51,90.17 | 156.21,90.17 MK.A | 143.51,90.17 156.21,90.17 | 168.91,90.17 END.A | 156.21,90.17 168.91,90.17 | 181.61,90.17 SE.A | 168.91,90.17 181.61,90.17 | 194.31,90.17 PAR.A | 181.61,90.17 194.31,90.17 | 207.01,90.17 TIM.A | 194.31,90.17 207.01,90.17 | 219.71,90.17 MF0.A | 207.01,90.17 219.71,90.17 | 232.41,90.17 MF1.A | 219.71,90.17 232.41,90.17 | 245.11,90.17 MF2.A | 232.41,90.17 245.11,90.17 | 257.81,90.17 DTF.A | 245.11,90.17 257.81,90.17 | 283.21,90.17 DF.A | 257.81,90.17 283.21,90.17 | 295.91,90.17 W.A | 283.21,90.17 295.91,90.17 | 308.61,90.17 WC.A | 295.91,90.17 308.61,90.17 | 321.31,90.17 UTS.A | 308.61,90.17 321.31,90.17 | 334.01,90.17 BM.A | 321.31,90.17 334.01,90.17 | 346.71,90.17 RC.A | 334.01,90.17 346.71,90.17 | 359.41,90.17 D.A | 346.71,90.17 359.41,90.17 | 372.11,90.17 F.A | 359.41,90.17 372.11,90.17 | 384.81,90.17 CK.A | 372.11,90.17 384.81,90.17 | 397.51,90.17 IDLE.A | 384.81,90.17 397.51,90.17 | 410.21,90.17 MC0.A | 397.51,90.17 410.21,90.17 | 422.91,90.17 MC1.A | 410.21,90.17 422.91,90.17 | MC2.A 435.61,90.17 422.91,90.17
W01
  Bottom 0.406: IC5.3 326.39,33.02 304.8,11.43 303.53,11.43 SV2.22
W02
  Bottom 0.406: IC5.9 341.63,24.13 331.47,24.13 320.04,12.7 314.96,12.7 313.69,11.43 313.69,8.89 306.07,8.89 SV2.20
W03
  Bottom 0.406: IC5.13 339.09,31.75 328.93,31.75 SV2.18
W04
  Bottom 0.406: IC11.3 369.57,29.21 332.74,29.21 318.77,15.24 314.96,15.24 SV2.16
W05
  Bottom 0.406: IC11.9 379.73,26.67 332.74,26.67 320.04,13.97 314.96,13.97 312.42,11.43 SV2.14
W06
  Top 0.406: IC11.13 384.81,39.37 384.81,72.39 387.35,74.93 389.89,74.93 389.89,29.21 374.65,13.97 314.96,13.97 SV2.12
W07
  Bottom 0.406: IC6.3 415.29,36.83 415.29,43.18 299.72,43.18 298.45,41.91 298.45,15.24 294.64,11.43 293.37,11.43 293.37,5.08 314.96,5.08 316.23,6.35 316.23,10.16 SV2.10
W08
  Top 0.406: IC6.9 402.59,8.89 330.2,8.89 330.2,6.35 328.93,5.08 321.31,5.08 321.31,8.89 SV2.8
W09
  Bottom 0.406: IC6.13 422.91,31.75 445.77,31.75 447.04,30.48 447.04,10.16 330.2,10.16 328.93,8.89 323.85,8.89 SV2.6
WB00
  Bottom 0.406: IC1.3 149.86,12.7 93.98,12.7 SV1.12
WB01
  Bottom 0.406: IC1.9 176.53,25.4 175.26,24.13 175.26,8.89 107.95,8.89 105.41,6.35 95.25,6.35 95.25,10.16 SV1.10
WB02
  Top 0.406: IC1.13 176.53,34.29 176.53,30.48 171.45,25.4 171.45,24.13 142.24,24.13 142.24,21.59 135.89,15.24 96.52,15.24 SV1.8
WC
  Top 0.406: IC10.11 306.07,29.21 306.07,16.51 300.99,11.43 300.99,8.89 SV2.23
WR_EN
  Top 0.406: IC10.5 295.91,26.67 295.91,8.89 SV2.25

### Text on the board
Document: USR | MR | FR | ENI | EF | MK | END | SE | PAR | TIM | MF | DTF | DF | W | UTS | STATE | WC | MC | 0 | 1 | 2 | 0 | 1 | 0 | 1 | 2 | 3 | 0 | 1 | 2 | BM | RC | D | F | CK | 0 | 1 | 2 | DTB | WB | LPB | C0 | C1 | MKT | WINDOW | WTM | 0 | 1 | 2 | 3 | 4 | 5 | 6 | 7 | 8 | 9 | 10 | 11 | 0 | 1 | 2 | 0 | 1 | 2 | 3 | 4 | 5 | 1 | 2 | 3 | 4 | 5 | 6 | 7 | 8 | 9